# EAGLE design Opto Testbench (EAGLE 9.6.2)
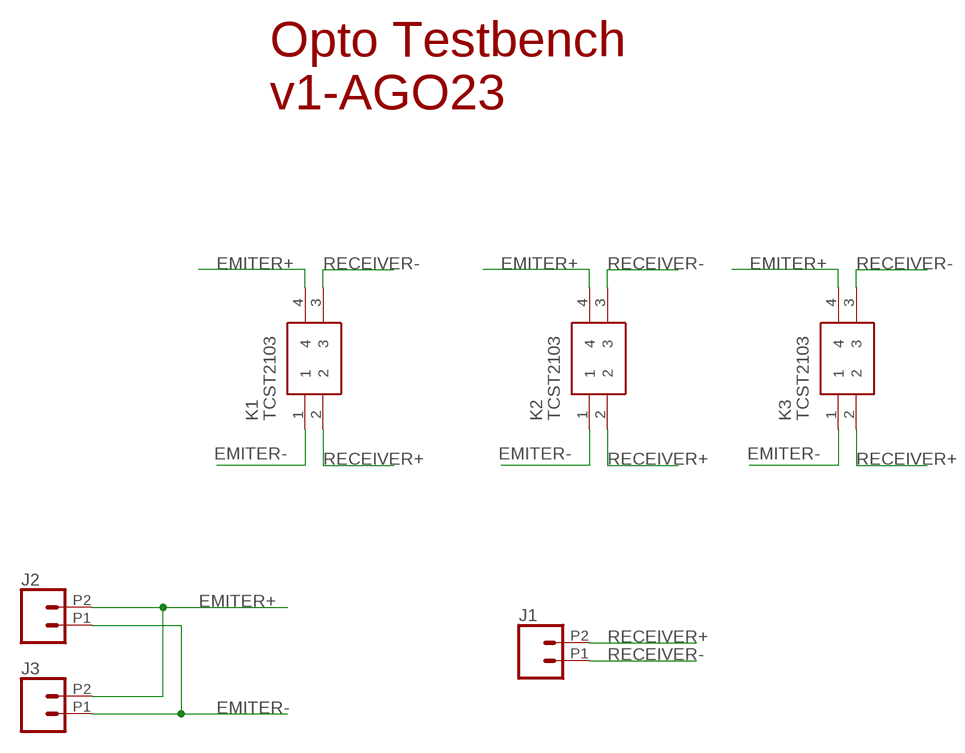
[diagram p0: schematic, sheet 1]

## Parts
J1  CONN_022.54MM_SCREWTERM  [1X02_2.54_SCREWTERM]
J2  CONN_022.54MM_SCREWTERM  [1X02_2.54_SCREWTERM]
J3  CONN_022.54MM_SCREWTERM  [1X02_2.54_SCREWTERM]
K1  TCST2103  [DIPS254W40P760L2450H1110Q4N]
K2  TCST2103  [DIPS254W40P760L2450H1110Q4N]
K3  TCST2103  [DIPS254W40P760L2450H1110Q4N]

## Nets
EMITER+: J2.P2 J3.P2 K1.4 K2.4 K3.4
EMITER-: J2.P1 J3.P1 K1.1 K2.1 K3.1
RECEIVER+: J1.P2 K1.2 K2.2 K3.2
RECEIVER-: J1.P1 K1.3 K2.3 K3.3

## Notes on the sheet
- Opto Testbench
  v1-AGO23

## Library data of the parts
J1-J3 = SparkFun-Connectors:CONN_02: Multi connection point. Often used as Generic Header-pin footprint for 0.1 inch spaced/style header connections On any of the 0.1 inch spaced packages, you can populate with these: Break Away Headers - Straight <https://www.sparkfun.com/products/116> (PRT-00116) Break Away Male Headers - Right Angle <https://www.sparkfun.com/products/553> (PRT-00553) Female Headers <https://www.sparkfun.com/products/115> (PRT-00115) Break Away Headers - Machine Pin <https://www.sparkfun.com/products/117> (PRT-00117) Break Away Female Headers - Swiss Machine Pin <https://www.sparkfun.com/products/743> (PRT-00743) For SCREWTERMINALS and SPRING TERMINALS visit here: Screw Terimnals on SparkFun.com <https://www.sparkfun.com/search/results?term=Screw+Terminals> (5mm/3.5mm/2.54mm spacing) This device is also useful as a general connection point to wire up your design to another part of your project. Our various solder wires solder well into these plated through hole pads. Hook-Up Wire - Assortment (Stranded, 22 AWG) <https://www.sparkfun.com/products/11375> (PRT-11375) Hook-Up Wire - Assortment (Solid Core, 22 AWG) <https://www.sparkfun.com/products/11367> (PRT-11367) View the entire wire category on our website here <https://www.sparkfun.com/categories/141> Special notes: Molex polarized connector foot print use with: PRT-08233 with associated crimp pins and housings. 2.54_SCREWTERM for use with PRT-10571. 3.5mm Screw Terminal footprints for PRT-08084 5mm Screw Terminal footprints for use with PRT-08432
K1-K3 = TCST2103:TCST2103: Photointerrupter Transmissive 3.1mm Source: Datasheet <https://componentsearchengine.com/Datasheets/2/TCST2103.pdf>; ARROW_PART_NUMBER: TCST2103; ARROW_PRICE-STOCK: https://www.arrow.com/en/products/tcst2103/vishay?region=europe; DESCRIPTION: Photointerrupter Transmissive 3.1mm; HEIGHT: 11.1mm; MANUFACTURER_NAME: Vishay; MANUFACTURER_PART_NUMBER: TCST2103; MOUSER_PART_NUMBER: 782-TCST2103; MOUSER_PRICE-STOCK: https://www.mouser.co.uk/ProductDetail/Vishay-Semiconductors/TCST2103?qs=%2Fjqivxn91cc%252BOKE9BUKCsA%3D%3D

## Board
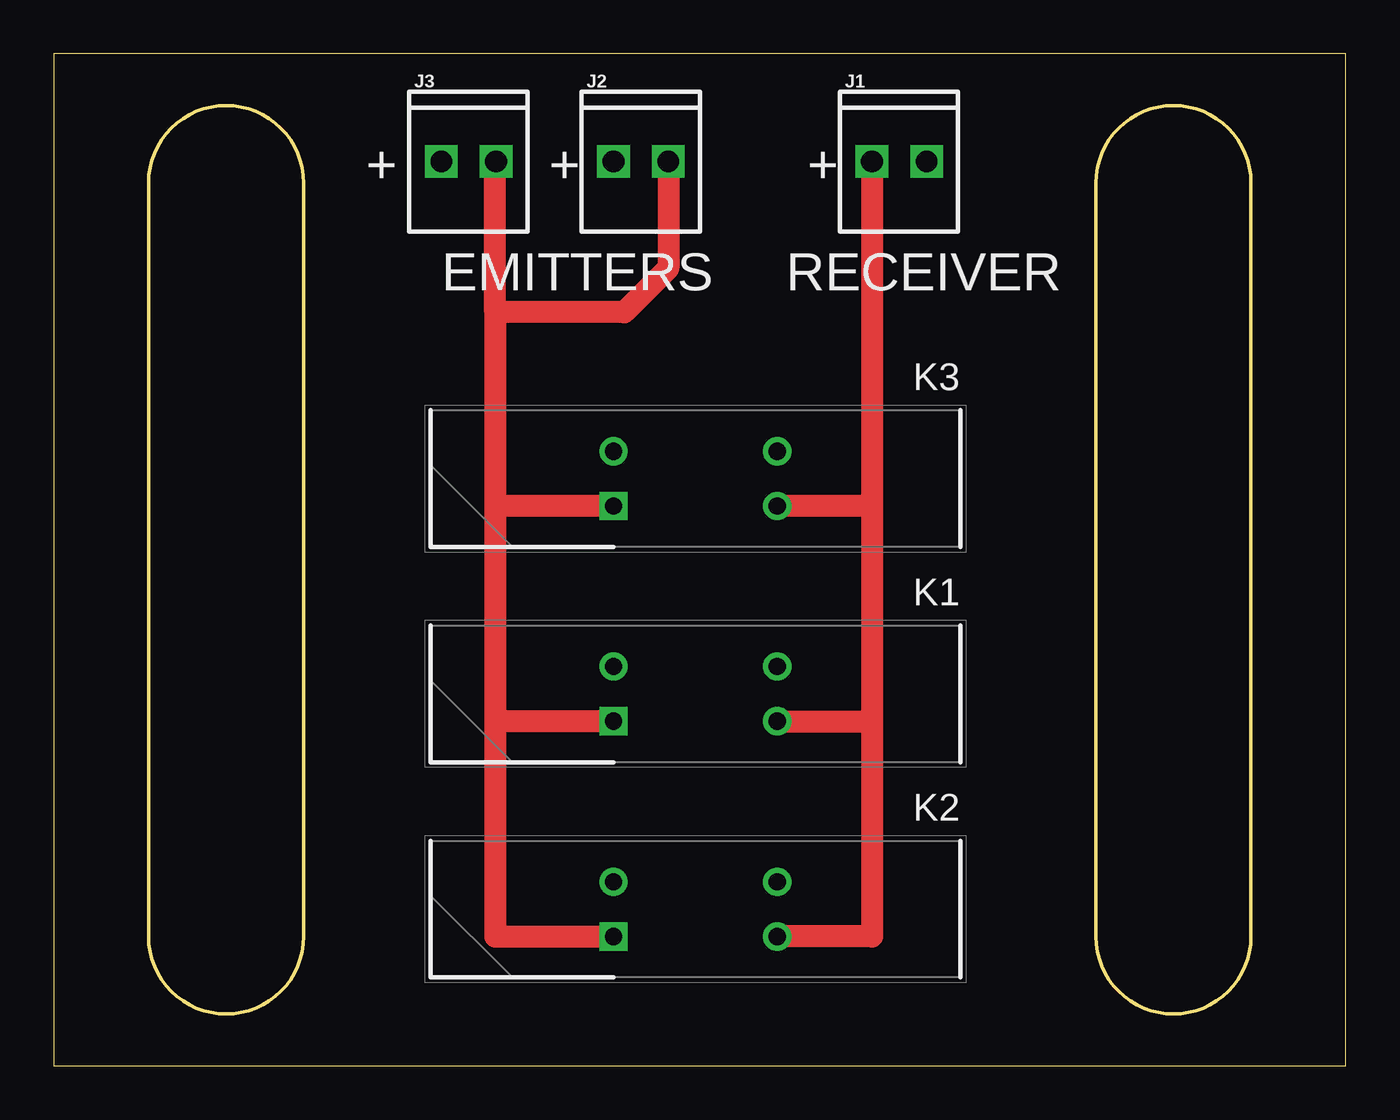
[diagram p1: board, top side]
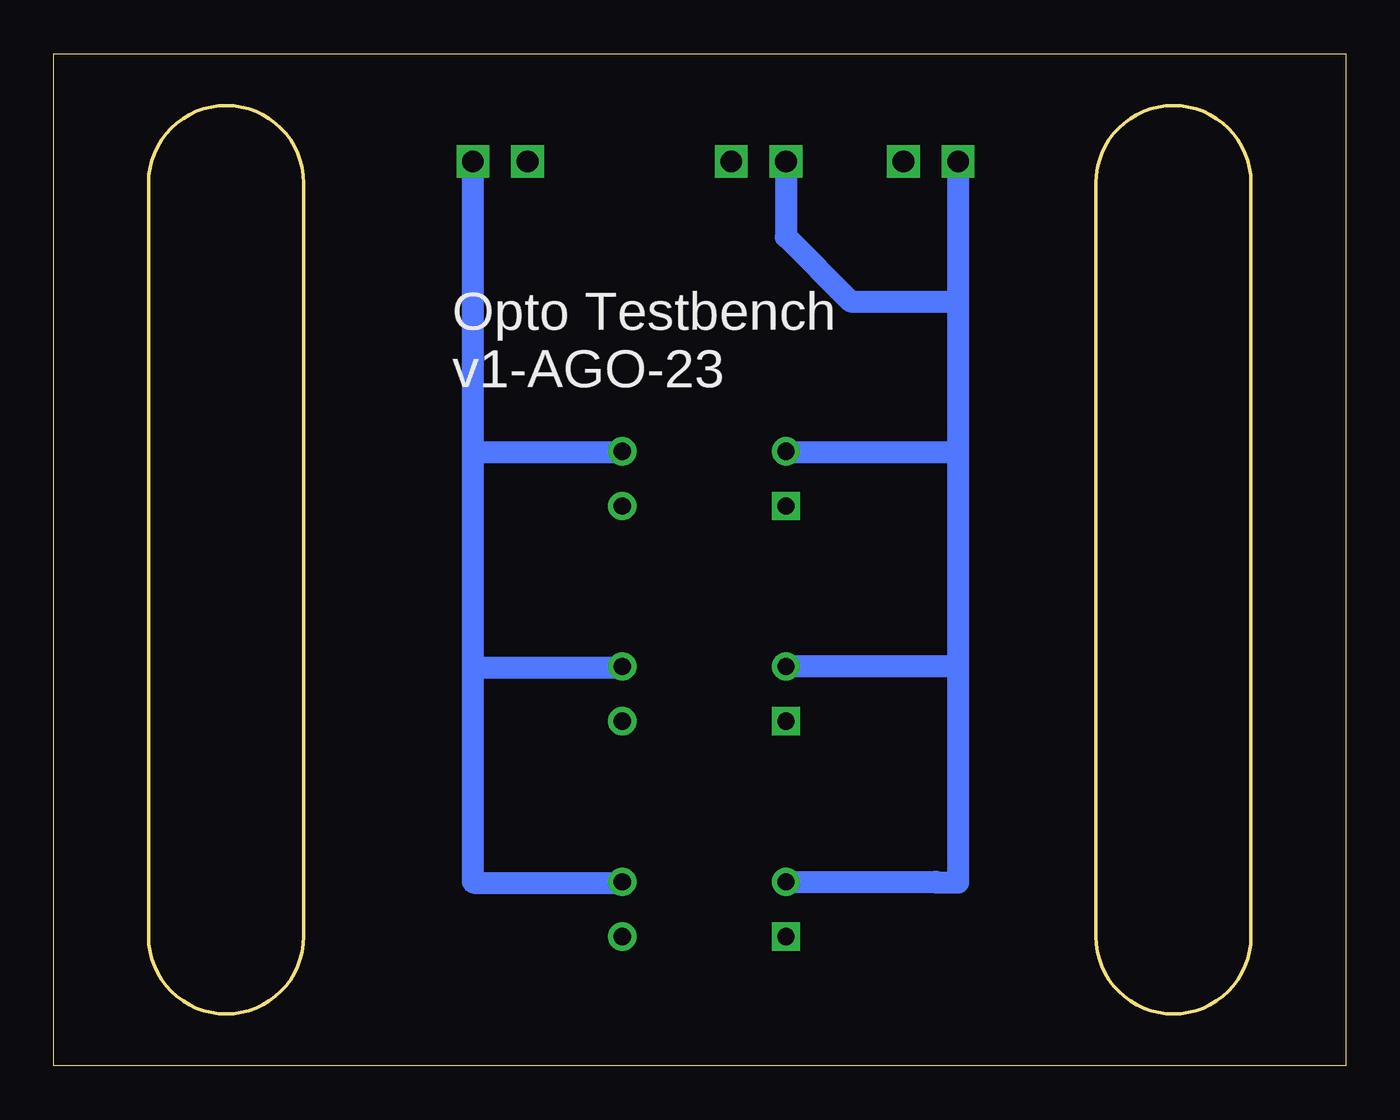
[diagram p2: board, bottom side, seen from below]

Size 60 x 47 mm. Coordinates in mm from the lower left corner, seen from the top.
Outline: 0,0 60,0 60,47 0,47 0,0
Outline: 4.4,41 4.4,6 arc180 11.6,6 11.6,41 arc180 4.4,41
Outline: 48.4,41 48.4,6 arc180 55.6,6 55.6,41 arc180 48.4,41
Copper layers (1*16): Top 0.035mm / dielectric 1.5mm / Bottom 0.035mm
Design rules "default": minimum track width 6mil, minimum drill 0.35mm, track to track 6mil, track to pad 6mil, pad to pad 6mil, via to via 6mil, smd to smd 6mil, copper to edge 40mil, drill to drill 6mil, minimum pad ring 10mil, minimum via ring 8mil, stop-mask expansion 4mil, vias tented up to drill 0mil, thermal gap 10mil

### Footprints (pad centres in the part's own frame; a part is rotated, then mirrored left to right if it is on the bottom)
1X02_2.54_SCREWTERM = drill 1.016 square: P1 2.54,0; P2 0,0
DIPS254W40P760L2450H1110Q4N = drill 0.8 pad 1.2 square: 1 0,0 | drill 0.8 pad 1.2: 2 0,-7.6; 3 2.54,-7.6; 4 2.54,0

### Placement (x,y rotation side)
J1  38,42 0 top
J2  26,42 0 top
J3  18,42 0 top
K1  26,16 90 top
K2  26,6 90 top
K3  26,26 90 top

### Tracks (layer width: path | path; a pad name or v marks a point on that pad's centre or on a via)
EMITER+
  Bottom 1.016: K2.4 19.04,8.54 19,8.5 18,8.5 18,18.5 | J3.P2 18,35.5 | 18,35.5 18,28.5 | 18,28.5 18,18.5 | 18,18.5 18.04,18.54 K1.4 | K3.4 25.96,28.5 18,28.5 | J2.P2 26,38.5 23,35.5 18,35.5
EMITER-
  Top 1.016: J2.P1 28.54,37.04 26.5,35 20.5,35 | 20.5,35 20.5,41.96 J3.P1 | 20.5,35 20.5,26 | 20.5,26 20.5,16 | 20.5,16 20.5,6 K2.1 | K1.1 20.5,16 | K3.1 20.5,26
RECEIVER+
  Top 1.016: J1.P2 38,26 | 38,26 K3.2 | 38,26 38,16 | 38,16 38,6 K2.2 | K1.2 38,16
RECEIVER-
  Bottom 1.016: J1.P1 40.54,28.54 | 40.54,28.54 40.5,28.5 33.64,28.5 K3.3 | 40.54,28.54 40.54,18.54 | 40.54,18.54 40.5,18.5 33.64,18.5 K1.3 | 40.54,18.54 40.54,8.54 40.5,8.5 33.64,8.5 K2.3

### Text on the board
tPlace: + | + | + | EMITTERS | RECEIVER
bPlace: Opto Testbench / v1-AGO-23